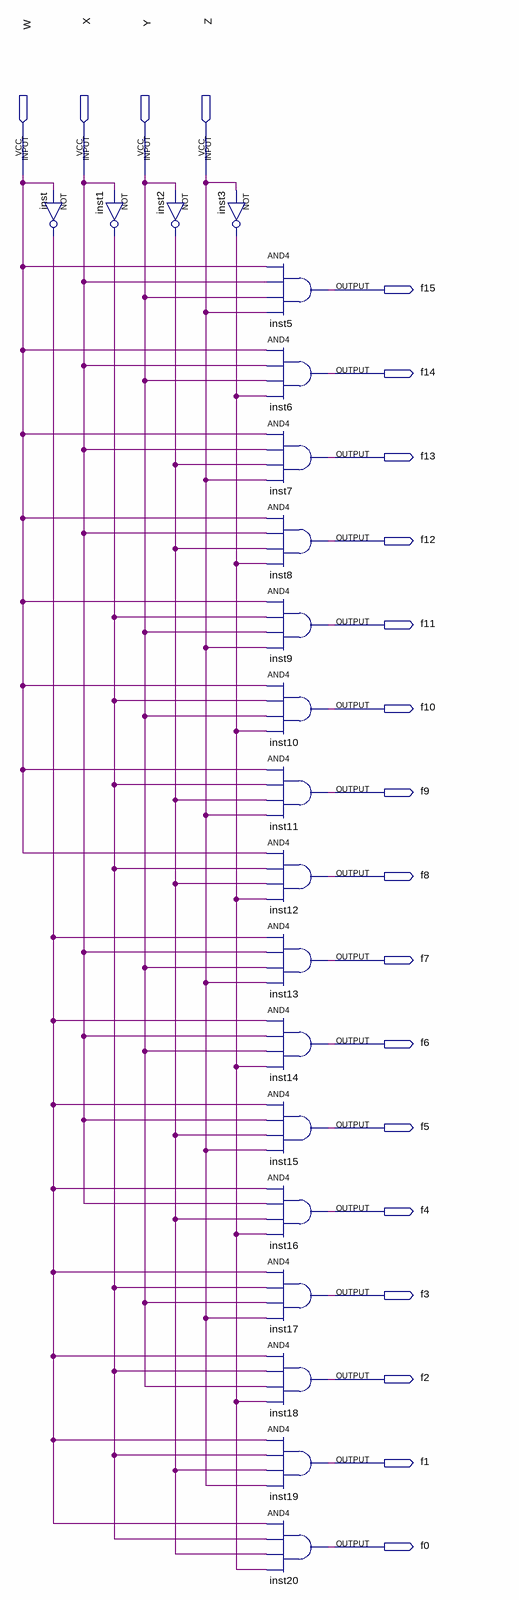
[diagram p0: schematic sheet]
// Quartus schematic Lab3_p2.bdf as structural Verilog: 20 symbols, 20 pins
module Lab3_p2 (
  input  W,
  input  X,
  input  Y,
  input  Z,
  output f15,
  output f14,
  output f13,
  output f12,
  output f11,
  output f10,
  output f9,
  output f8,
  output f7,
  output f6,
  output f5,
  output f4,
  output f3,
  output f2,
  output f1,
  output f0
);

  wire inst1_out, inst2_out, inst3_out, inst_out;

  not inst (inst_out, W);
  not inst1 (inst1_out, X);
  not inst2 (inst2_out, Y);
  not inst3 (inst3_out, Z);
  and inst5 (f15, W, X, Y, Z);
  and inst6 (f14, W, X, Y, inst3_out);
  and inst7 (f13, W, X, inst2_out, Z);
  and inst8 (f12, W, X, inst2_out, inst3_out);
  and inst9 (f11, W, inst1_out, Y, Z);
  and inst10 (f10, W, inst1_out, Y, inst3_out);
  and inst11 (f9, W, inst1_out, inst2_out, Z);
  and inst12 (f8, W, inst1_out, inst2_out, inst3_out);
  and inst13 (f7, inst_out, X, Y, Z);
  and inst14 (f6, inst_out, X, Y, inst3_out);
  and inst15 (f5, inst_out, X, inst2_out, Z);
  and inst16 (f4, inst_out, X, inst2_out, inst3_out);
  and inst17 (f3, inst_out, inst1_out, Y, Z);
  and inst18 (f2, inst_out, inst1_out, Y, inst3_out);
  and inst19 (f1, inst_out, inst1_out, inst2_out, Z);
  and inst20 (f0, inst_out, inst1_out, inst2_out, inst3_out);
endmodule
